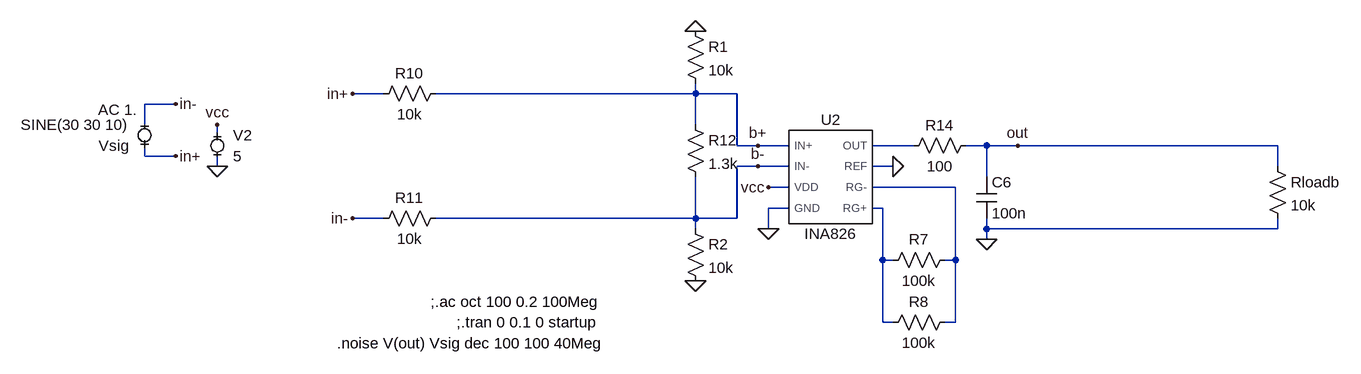
[diagram p0: schematic tina826-test.asc]
tina826-test.asc, the LTspice schematic file:
Version 4
SHEET 1 2008 680
WIRE -688 -288 -736 -288
WIRE -208 -288 -208 -304
WIRE -208 -288 -608 -288
WIRE -144 -288 -208 -288
WIRE -1008 -272 -1056 -272
WIRE -1056 -240 -1056 -272
WIRE -208 -240 -208 -288
WIRE -944 -224 -944 -240
WIRE -144 -208 -144 -288
WIRE -112 -208 -144 -208
WIRE -64 -208 -112 -208
WIRE 128 -208 64 -208
WIRE 240 -208 208 -208
WIRE 288 -208 240 -208
WIRE 688 -208 288 -208
WIRE -1056 -192 -1056 -208
WIRE -1008 -192 -1056 -192
WIRE -944 -176 -944 -192
WIRE -112 -176 -144 -176
WIRE -64 -176 -112 -176
WIRE 96 -176 64 -176
WIRE 688 -176 688 -208
WIRE 240 -160 240 -208
WIRE -64 -144 -96 -144
WIRE 192 -144 64 -144
WIRE -64 -112 -96 -112
WIRE 80 -112 64 -112
WIRE -688 -96 -736 -96
WIRE -208 -96 -208 -160
WIRE -208 -96 -608 -96
WIRE -144 -96 -144 -176
WIRE -144 -96 -208 -96
WIRE -208 -80 -208 -96
WIRE -96 -80 -96 -112
WIRE 240 -80 240 -96
WIRE 688 -80 688 -96
WIRE 688 -80 240 -80
WIRE 240 -64 240 -80
WIRE 80 -32 80 -112
WIRE 96 -32 80 -32
WIRE 192 -32 192 -144
WIRE 192 -32 176 -32
WIRE 80 64 80 -32
WIRE 96 64 80 64
WIRE 192 64 192 -32
WIRE 192 64 176 64
FLAG -944 -176 0
FLAG -944 -240 vcc
FLAG -1008 -192 in+
FLAG -1008 -272 in-
FLAG -736 -288 in+
FLAG -736 -96 in-
FLAG -96 -144 vcc
FLAG -96 -80 0
FLAG 96 -176 0
FLAG -112 -208 b+
FLAG -112 -176 b-
FLAG 288 -208 out
FLAG 240 -64 0
FLAG -208 -384 0
FLAG -208 0 0
SYMBOL MiniSyms4\\voltage- -1056 -224 R180
WINDOW 123 11 39 Left 2
WINDOW 39 0 0 Left 2
SYMATTR Value2 AC 1.
SYMATTR InstName Vsig
SYMATTR Value SINE(30 30 10)
SYMBOL MiniSyms4\\voltage- -944 -208 R0
WINDOW 123 0 0 Left 0
WINDOW 39 0 0 Left 0
SYMATTR InstName V2
SYMATTR Value 5
SYMBOL AutoGenerated\\INA826 0 -160 R0
SYMATTR InstName U2
SYMBOL res 192 -48 R90
WINDOW 0 0 56 VBottom 2
WINDOW 3 32 56 VTop 2
SYMATTR InstName R7
SYMATTR Value 100k
SYMBOL res -592 -304 R90
WINDOW 0 0 56 VBottom 2
WINDOW 3 32 56 VTop 2
SYMATTR InstName R10
SYMATTR Value 10k
SYMBOL res -592 -112 R90
WINDOW 0 0 56 VBottom 2
WINDOW 3 32 56 VTop 2
SYMATTR InstName R11
SYMATTR Value 10k
SYMBOL res -224 -256 R0
SYMATTR InstName R12
SYMATTR Value 1.3k
SYMBOL cap 224 -160 R0
SYMATTR InstName C6
SYMATTR Value 100n
SYMBOL res 224 -224 R90
WINDOW 0 0 56 VBottom 2
WINDOW 3 32 56 VTop 2
SYMATTR InstName R14
SYMATTR Value 100
SYMBOL res 672 -192 R0
SYMATTR InstName Rloadb
SYMATTR Value 10k
SYMBOL res 192 48 R90
WINDOW 0 0 56 VBottom 2
WINDOW 3 32 56 VTop 2
SYMATTR InstName R8
SYMATTR Value 100k
SYMBOL res -224 -400 R0
SYMATTR InstName R1
SYMATTR Value 10k
SYMBOL res -224 -96 R0
SYMATTR InstName R2
SYMATTR Value 10k
TEXT -616 32 Left 2 !;.ac oct 100 0.2 100Meg
TEXT -576 64 Left 2 !;.tran 0 0.1 0 startup
TEXT -760 96 Left 2 !.noise V(out) Vsig dec 100 100 40Meg

The netlist it stands for:
* tina826-test.asc
Vsig in+ in- SINE(30 30 10) AC 1.
V2 vcc 0 5
XU2 b+ b- vcc 0 N001 0 N002 N003 INA826  ; pins IN+ IN- VDD GND OUT REF RG- RG+
R7 N002 N003 100k
R10 b+ in+ 10k
R11 b- in- 10k
R12 b+ b- 1.3k
C6 out 0 100n
R14 out N001 100
Rloadb out 0 10k
R8 N002 N003 100k
R1 0 b+ 10k
R2 b- 0 10k
;.ac oct 100 0.2 100Meg
;.tran 0 0.1 0 startup
.noise V(out) Vsig dec 100 100 40Meg
.lib C:\users\joaoantoniocardoso\Desktop\tina-spice\INA826_TINA_AIO\INA826.lib
.backanno
.end